# Altium schematic sheet Bopit.SchDoc
size C; SheetNumber: 1; SheetTotal: 1
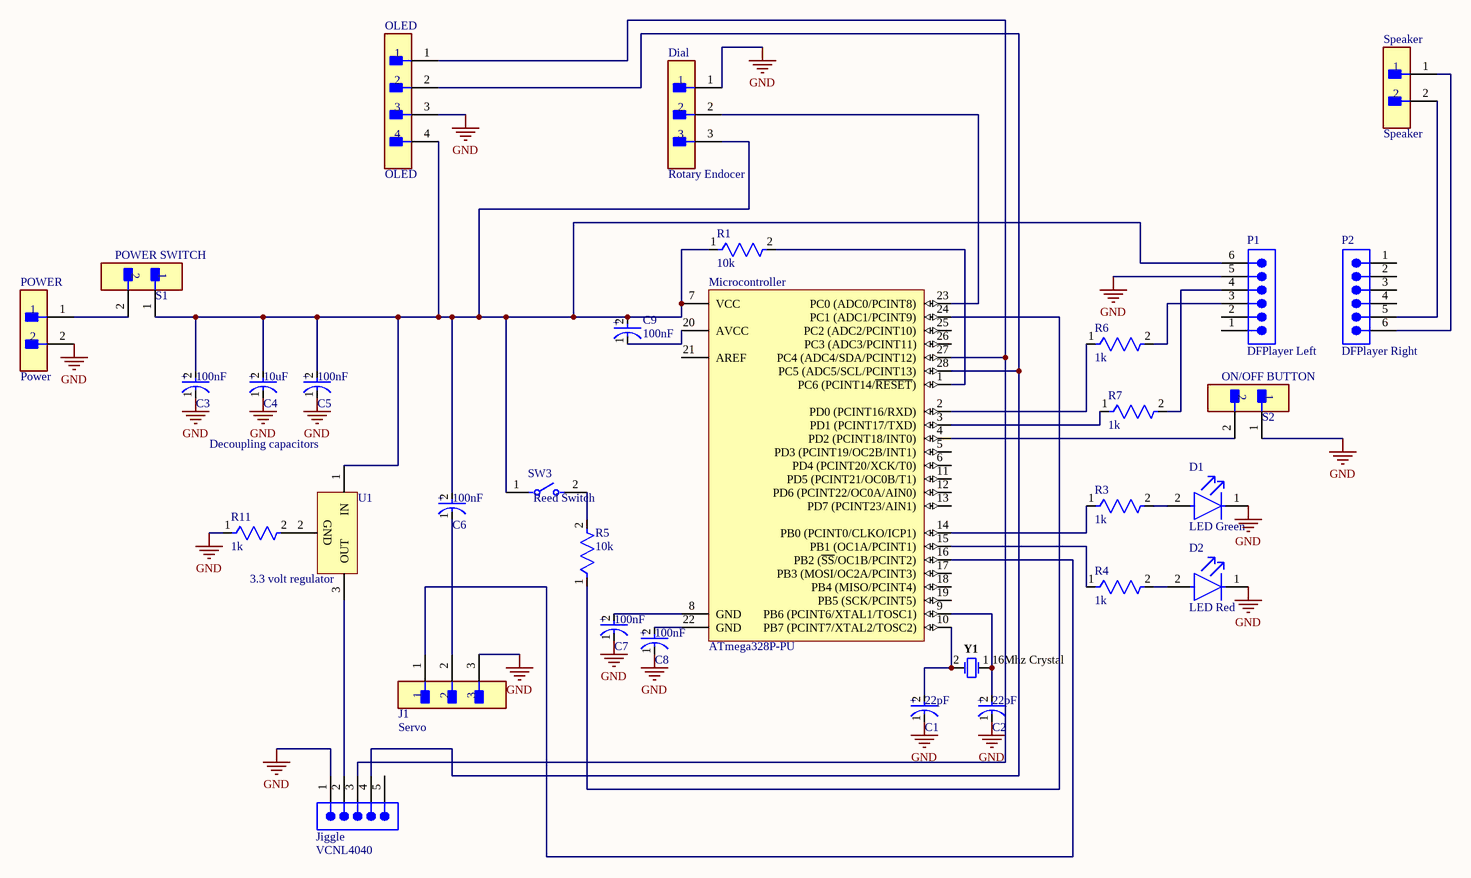
[diagram p0: Bopit.SchDoc]

## Parts
C1  22pF  [FP-RAD-TH-D_6_3_0_5-L_11-MFG]
C2  22pF  [FP-RAD-TH-D_6_3_0_5-L_11-MFG]
C3  100nF  [FP-RAD-TH-D_6_3_0_5-L_11-MFG]
C4  10uF  [FP-RAD-TH-D_6_3_0_5-L_11-MFG]
C5  100nF  [FP-RAD-TH-D_6_3_0_5-L_11-MFG]
C6  100nF  [FP-RAD-TH-D_6_3_0_5-L_11-MFG]
C7  100nF  [FP-RAD-TH-D_6_3_0_5-L_11-MFG]
C8  100nF  [FP-RAD-TH-D_6_3_0_5-L_11-MFG]
C9  100nF  [FP-RAD-TH-D_6_3_0_5-L_11-MFG]
D1  LED Green  [FP-SSL-LX5093YD-MFG]
D2  LED Red  [FP-SSL-LX5093YD-MFG]
Dial  Rotary Endocer  [FP-TSW-103-14-G-S-MFG]
J1  Servo  [FP-TSW-103-14-G-S-MFG]
Jiggle  VCNL4040  [SMTC-TSW-105-05-X-S]
Microcontroller  ATmega328P-PU  [28P3]
OLED  OLED  [FP-TSW-104-22-G-S-MFG]
P1  DFPlayer Left  [SMTC-TSW-106-17-X-S-LL]
P2  DFPlayer Right  [SMTC-TSW-106-17-X-S-LL]
POWER  Power  [FP-TMM-102-03-F-S-MFG]
R1  10k  [FP-FMP100-MFG]
R3  1k  [FP-FMP100-MFG]
R4  1k  [FP-FMP100-MFG]
R5  10k  [FP-FMP100-MFG]
R6  1k  [FP-FMP100-MFG]
R7  1k  [FP-FMP100-MFG]
R11  1k  [FP-FMP100-MFG]
S1  POWER SWITCH  [FP-TMM-102-04-G-S-MFG]
S2  ON/OFF BUTTON  [FP-TMM-102-04-G-S-MFG]
Speaker  Speaker  [FP-TMM-102-03-F-S-MFG]
SW3  Reed Switch  [FP-MLRR-3-17-23-MFG]
U1  3.3 volt regulator  [ONSC-TO-220-3-221AB-01]
Y1  16Mhz Crystal  [FOX-FOXSLF160-20]

## Nets
GND: C1.1(C) C2.1(C) C3.1(C) C4.1(C) C5.1(C) C7.1(C) C8.1(C) D1.1(C) D2.1(C) Dial.1 J1.3 Jiggle.1 OLED.3 P1.5 POWER.2 R11.1 S2.1
NetC1_2: C1.2(A) Microcontroller.10(PB7_(PCINT7/XTAL2/TOSC2)) Y1.2
NetC2_2: C2.2(A) Microcontroller.9(PB6_(PCINT6/XTAL1/TOSC1)) Y1.1
NetC3_2: C3.2(A) C4.2(A) C5.2(A) C6.2(A) C9.2(A) Dial.3 Microcontroller.7(VCC) OLED.4 P1.6 R1.1 S1.1 SW3.1 U1.1(IN)
NetC6_1: C6.1(C) J1.2
NetC7_2: C7.2(A) Microcontroller.8(GND)
NetC8_2: C8.2(A) Microcontroller.22(GND)
NetC9_1: C9.1(C) Microcontroller.20(AVCC)
NetD1_2: D1.2(A) R3.2
NetD2_2: D2.2(A) R4.2
NetDial_2: Dial.2 Microcontroller.23(PC0_(ADC0/PCINT8))
NetJ1_1: J1.1 Microcontroller.16(PB2_(~{SS}/OC1B/PCINT2))
NetJiggle_2: Jiggle.2 U1.3(OUT)
NetJiggle_3: Jiggle.3 Microcontroller.27(PC4_(ADC4/SDA/PCINT12)) OLED.1
NetJiggle_4: Jiggle.4 Microcontroller.28(PC5_(ADC5/SCL/PCINT13)) OLED.2
NetMicrocontroller_1: Microcontroller.1(PC6_(PCINT14/~{RESET})) R1.2
NetMicrocontroller_2: Microcontroller.2(PD0_(PCINT16/RXD)) R6.1
NetMicrocontroller_3: Microcontroller.3(PD1_(PCINT17/TXD)) R7.1
NetMicrocontroller_4: Microcontroller.4(PD2_(PCINT18/INT0)) S2.2
NetMicrocontroller_14: Microcontroller.14(PB0_(PCINT0/CLKO/ICP1)) R3.1
NetMicrocontroller_15: Microcontroller.15(PB1_(OC1A/PCINT1)) R4.1
NetMicrocontroller_24: Microcontroller.24(PC1_(ADC1/PCINT9)) R5.1
NetP1_3: P1.3 R6.2
NetP1_4: P1.4 R7.2
NetP2_5: P2.5 Speaker.2
NetP2_6: P2.6 Speaker.1
NetPOWER_1: POWER.1 S1.2
NetR5_2: R5.2 SW3.2
NetR11_2: R11.2 U1.2(GND)

Not connected (* = marked no-connect by the designer): Jiggle 5; Microcontroller 5(PD3_(PCINT19/OC2B/INT1)) 6(PD4_(PCINT20/XCK/T0)) 11(PD5_(PCINT21/OC0B/T1)) 12(PD6_(PCINT22/OC0A/AIN0)) 13(PD7_(PCINT23/AIN1)) 17(PB3_(MOSI/OC2A/PCINT3)) 18(PB4_(MISO/PCINT4)) 19(PB5_(SCK/PCINT5)) 21(AREF) 25(PC2_(ADC2/PCINT10)) 26(PC3_(ADC3/PCINT11)); P1 1 2; P2 1 2 3 4

## Notes on the sheet
- Decoupling capacitors
- (in symbol CMP-05427-000779-1) +

## Library data of the parts
C1-C9 = CMP-05427-000779-1: Aluminum Electrolytic Capacitors (Radial Lead Type) 2.2uF ±20% 250V; Lead Diameter: 0.5mm; Lead/Base Style: Straight; Ripple Current: 29mA; Life (Hours): 2000Hour; Package Quantity: 2000; Height: 11.2mm; Tolerance: 20%; Mount: Through Hole; Length: 11.2mm; Height - Seated (Max): 0.48inch; Voltage Rating: 250V; Capacitance: 2.2uF; Max Operating Temperature: 105°C; Voltage Rating (DC): 250V; Diameter: 6.3mm; Packaging: Ammo Pack; Radiation Hardening: No; Case/Package: Radial; Termination: Radial; Min Operating Temperature: -25°C; Lead Pitch: 2.5mm; Series: NHG
D1 D2 = CMP-57192-000007-1: LED YELLOW DIFFUSED T-1 3/4 T/H; Test Current: 20mA; Number of LEDs: 1; Dominant Wavelength: 568nm; Wavelength: 585nm; Forward Voltage: 2.1V; Lens Style: Dome; Viewing Angle: 60°; Luminous Intensity: 30mcd; Min Operating Temperature: -40°C; Packaging: Bulk; Width: 1.5inch; Lead Free: Lead Free; Number of Pins: 2; Color: Yellow; Case/Package: Radial; Forward Current: 20mA; REACH SVHC: No SVHC; Lens Transparency: Diffused; Weight: 0.01lb; Height: 8.6mm; Package Quantity: 1000; Series: -; Length: 0.5inch; Illumination Color: Yellow; Mount: Through Hole; Diameter: 5mm; RoHS Compliant: Yes; Lens Color: Yellow; Max Operating Temperature: 85°C
Dial J1 = CMP-02766-001743-1: CONN HEADER VERT 3POS 2.54MM; Max Voltage Rating (AC): 550V; Number of Positions: 3; Max Current Rating: 7.6A; Gender: Male; Termination: Solder; RoHS Compliant: Yes; Mount: Through Hole; Lead Free: Lead Free; Connector Type: Header; REACH SVHC: No SVHC; Insulation Color: Black; Width: 2.54mm; Length: 7.62mm; Flammability Rating: UL94 V-0; Housing Material: Polyester; Contact Material: Bronze; Max Operating Temperature: 125°C; Fastening Type: Pull; Series: TSW; Number of Contacts: 3; Packaging: Bulk; Min Operating Temperature: -55°C; Package Quantity: 1; Height: 10.67mm; Pitch: 2.54mm; Contact Finish - Mating: GOLD; Contact Type: Male Pin; Radiation Hardening: No; Color: Black; Housing Color: Black; Contact Plating: Gold; Orientation: Straight; Number of Rows: 1; Depth: 2.54mm; Insulation Material: PBT; Contact Mating Length: 0.32inch; Contact Shape: Square
Jiggle = CMP-1024-00366-1: 0.025" SQ Post Header, Through-hole, Vertical, -55 to 125 degC, 2.54 mm Pitch, 5-Pin, Male, RoHS; PartNumber: TSW-105-05-L-S; Manufacturer: Samtec; Pitch: 2.54 mm; PackageVersion: DM, 8/1988; Orientation: Vertical; Temperature Range: -55 to 125 degC; ComponentLink1Description: Manufacturer URL; PackageDescription: .025[0.64] SQ. Post Terminal Strip Assembly; ComponentLink2URL: http://www.samtec.com/documents/webfiles/pdf/TSW_TH.PDF; PackageReference: TSW-105-05-X-S; ComponentLink2Description: Datasheet; Mounting Technology: Through-hole; DatasheetVersion: F-214; ComponentLink1URL: http://www.samtec.com; RoHS: True; ComponentLink3URL: http://www.samtec.com/documents/webfiles/cpdf/TSW-XXX-XX-XXX-X-XX-XXX-MKT.pdf; ComponentLink3Description: Package Specification
Microcontroller = CMP-0095-00013-2: 8-bit AVR Microcontroller, 32KB Flash, 1KB EEPROM, 2KB SRAM, 28-pin PDIP, Industrial Grade (-40°C to 85°C); RevisionNote: DatasheetVersion updated. URLs added.; PackageVersion: revB, Sep-2001; PackageDescription: 28-lead (0.300"/7.62mm Wide) Plastic Dual Inline Package (PDIP); DatasheetVersion: revD, May-2011; ComponentLink1Description: Manufacturer URL; ComponentLink1URL: http://www.atmel.com/; PackageReference: 28P3; ComponentLink2Description: ATmega48A/48PA/88A/88PA/168A/168PA/328/328P Datasheet; ComponentLink3URL: http://www.atmel.com/dyn/resources/prod_documents/8271S.pdf; ComponentLink2URL: http://www.atmel.com/dyn/resources/prod_documents/8271.pdf; ComponentLink3Description: ATmega48A/48PA/88A/88PA/168A/168PA/328/328P Summary
OLED = CMP-02766-001236-1: CONN HEADER VERT 4POS 2.54MM; Number of Contacts: 4; Gender: Male; Termination: Solder; Pitch: 2.54mm; Mount: Through Hole; Number of Rows: 1; Packaging: Bulk; Contact Material: Bronze; Contact Plating: Gold; REACH SVHC: No SVHC; Radiation Hardening: No
P1 P2 = CMP-1024-00394-1: 0.025" SQ Post Header, Through-hole, Vertical, -55 to 125 degC, 2.54 mm Pitch, 6-Pin, Male, RoHS; PartNumber: TSW-106-17-L-S-LL; Manufacturer: Samtec; Pitch: 2.54 mm; ComponentLink3Description: Package Specification; PackageReference: TSW-106-17-X-S-LL; PackageVersion: DM, 8/1988; Orientation: Vertical; ComponentLink3URL: http://www.samtec.com/documents/webfiles/cpdf/TSW-XXX-XX-XXX-X-XX-XXX-MKT.pdf; RoHS: True; Temperature Range: -55 to 125 degC; ComponentLink1Description: Manufacturer URL; DatasheetVersion: F-214; ComponentLink2URL: http://www.samtec.com/documents/webfiles/pdf/TSW_TH.PDF; Mounting Technology: Through-hole; ComponentLink1URL: http://www.samtec.com; PackageDescription: .025[0.64] SQ. Post Terminal Strip Assembly; ComponentLink2Description: Datasheet
POWER Speaker = CMP-02766-001614-1: CONN HEADER VERT 2POS 2MM; Number of Contacts: 2; Gender: Male; Pitch: 2mm; Packaging: Bulk; RoHS Compliant: Yes; Termination: Solder; Contact Plating: Gold; Mount: Through Hole; Number of Rows: 1; Radiation Hardening: No; Lead Free: Lead Free
R1 R3-R7 R11 = CMP-00621-25629781-1: Resistor, 1 kOhm, ± 5%, 1 W, Axial Leaded, Metal Film, High Power Flame Proof; Power Rating: 1W; Resistance: 1kΩ; Temperature Coefficient: 100ppm/°C; Length: 6.3mm; Min Operating Temperature: -55°C; Tolerance: 5%; RoHS: Compliant; Military Standard: Not; Mount: Through Hole; Case/Package: Conformal; Diameter: 2.4mm; Schedule B: 8533210090, 8533210090; Radiation Hardening: No; Lead Free: Lead Free; Composition: Metal Film; Max Operating Temperature: 155°C; Termination: Axial
S1 S2 = CMP-02766-001609-1: 2MM TERMINAL STRIP; Max Voltage Rating (AC): 500V; Max Current Rating: 3.9A; Number of Contacts: 2; Gender: Male; Length: 4mm; Termination: Solder; Number of Rows: 1; Depth: 1.97mm; RoHS Compliant: Yes; Orientation: Straight; Packaging: Bulk; Pitch: 2mm; Max Operating Temperature: 125°C; Contact Material: Bronze; Radiation Hardening: No; Contact Plating: Gold; Housing Color: Black; Min Operating Temperature: -55°C; Housing Material: Polymer
SW3 = CMP-08625-000005-1: SWITCH REED SPST-NO 700MA 140V; Release Time: 0.2ms; Operate Time: 0.7ms; Throw Configuration: SPST; Capacitance: 0.4pF; Power Rating: 20W; Length: 56.6mm; Termination: Axial; Min Operating Temperature: -40°C; Packaging: Bulk; Series: MLRR-3; Mount: Through Hole; Max Operating Temperature: 125°C; Package Quantity: 100; Lead Free: Lead Free
U1 = CMP-2000-04928-1: Positive Voltage Regulator, 1 A, 5 V, 0 to 125 degC, 3-Pin TO-220, RoHS, Tube; Manufacturer: ON Semiconductor; Resistance, Thermal, Junction to Case: 5degC/W; Voltage, Supply: 35V; Regulator Function: Standard; Temperature, Operating, Maximum: +125degC; Load Regulation: 25mV; Regulator Type: PositiveVoltageOut; Current, Output, Maximum: 1A; Regulation, Load: 1.3mV; Number of Outputs: 1; Temperature, Operating, Range: 0to+125degC; Regulation, Line: 0.5mV; Line Regulation: 20mV; Voltage, Input Range: Maximumof35V; Output Type: Fixed; Current, Quiescent Supply: 6.5mA; Dropout Voltage: 2V; Temperature, Operating, Minimum: 0degC; Package Version: Rev. A, 11/2010; Current, Supply: 3.2mA; Voltage, Output: 5V; Voltage, Noise: 10μV/V; Package Type: TO-220; Voltage, Input, High Level: 35V; Datasheet URL: http://www.onsemi.com/pub_link/Collateral/MC7800-D.PDF; Dimensions: 10.28x4.82x15.75mm; Width: 4.82mm; Type: VoltageRegulator; Mounting Type: ThroughHole; Polarity: Positive; Datasheet Version: Rev. 27, 11/2014; Height: 15.75mm; Dropout Voltage Measurement Current: 1A; Package Description: 3-Pin Flange Mount, Vertical Straight Lead, Body 9.97 x 4.445 mm, Pitch 2.54 mm; Manufacturer URL: http://www.onsemi.com/; Voltage, Dropout: 2V; Length: 10.28mm; Number of Pins: 3; Package Reference: TO-220-3-221AB-01
Y1 = CMP-1749-00003-1: Resistance Weld Thru-Hole Crystal, 16 MHz, -20 to 70 degC, 2-Pin THD, RoHS, Bulk; Voltage Rating: 250 V; Tolerance: 1%; Resistance: 221 kohm; Case\Package: Axial; Power Rating: 250 mW; RoHSCompliant: true; Package Quantity: 200; Packaging: Bulk; Min Operating Temperature: -55 degC; DatasheetVersion: Mar-15; ComponentLink1URL: http://www.foxonline.com/; Max Operating Temperature: 155 degC; PackageReference: FOXSLF160-20; Mount: Through Hole; PackageDescription: 2-Pin Through Hole Device, Body 11.35 x 4.65 mm; ComponentLink1Description: Manufacturer URL; ComponentLink2URL: http://www.foxonline.com/pdfs/hc49slf.pdf; ComponentLink2Description: Datasheet; Length: 0.248 inch